# Altium schematic sheet MMA8452Q_Breakoutv10_zv1_1.SchDoc
size 249 x 185 mm
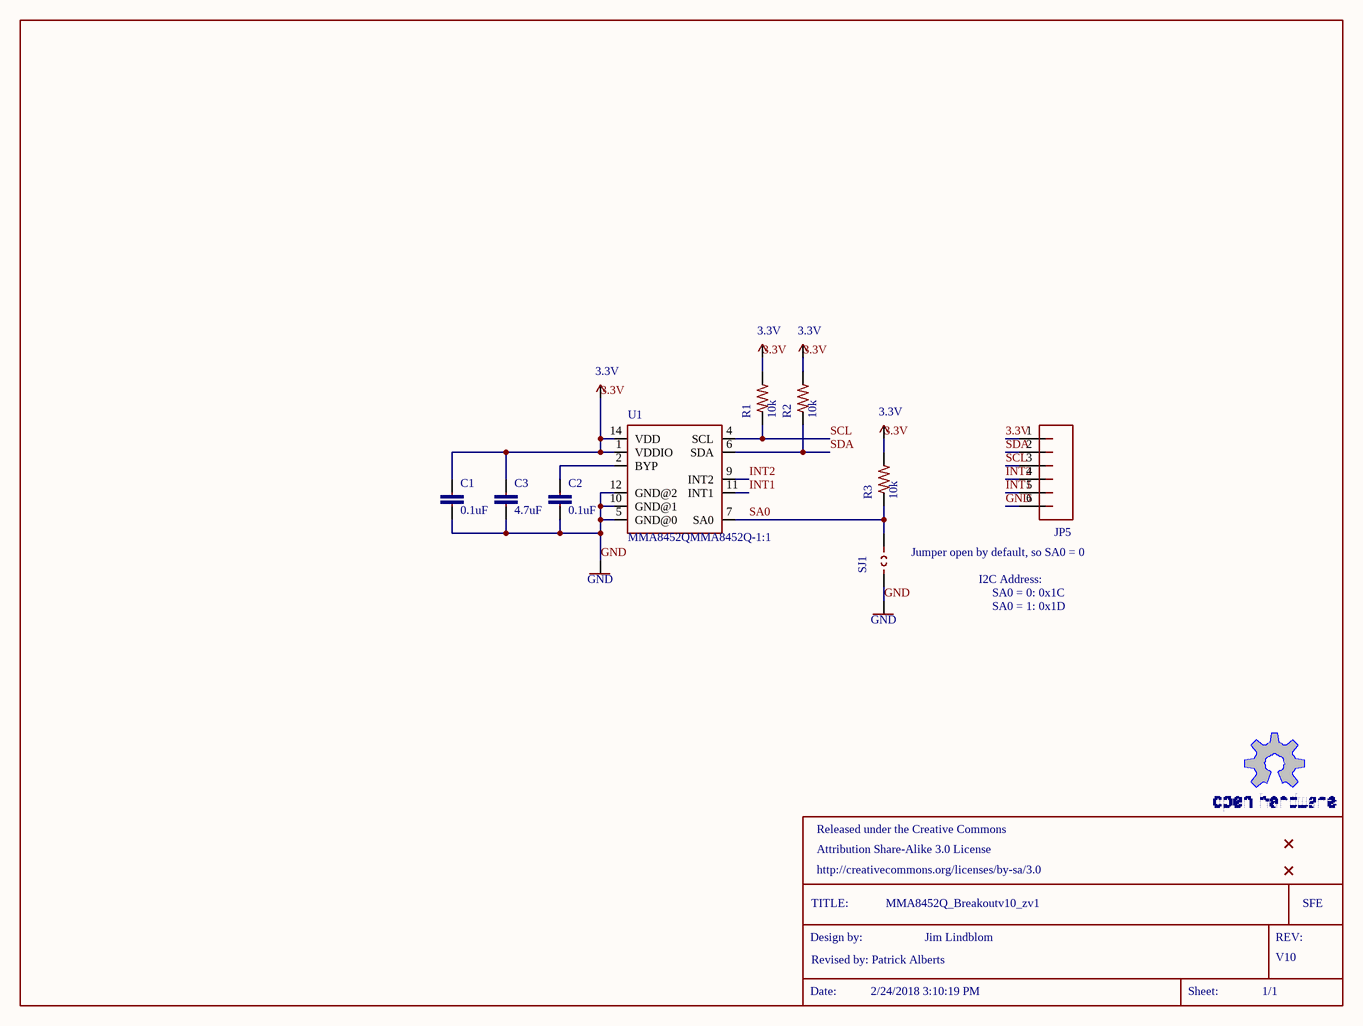
[diagram p0: MMA8452Q_Breakoutv10_zv1_1.SchDoc]

## Parts
C1  0.1uF  [0603-CAP]
C2  0.1uF  [0603-CAP]
C3  4.7uF  [0603-CAP]
FID1  (no value)  [FIDUCIAL-1X2]
FID2  (no value)  [FIDUCIAL-1X2]
FRAME1  (no value)  [CREATIVE_COMMONS]  (parts A,B of 2)
GND1  GND
GND2  GND
JP1  (no value)  [SFE-LOGO-FLAME]
JP3  (no value)  [STAND-OFF]
JP4  (no value)  [STAND-OFF]
JP5  (no value)  [1X06]
P+1  3.3V
P+2  3.3V
P+3  3.3V
P+4  3.3V
R1  10k  [0603-RES]
R2  10k  [0603-RES]
R3  10k  [0603-RES]
SJ1  (no value)  [SJ_2S-NO]
U1  MMA8452QMMA8452Q-1:1  [MMA8452Q-1:1]
U$1  (no value)  [OSHW-LOGO-S]

## Nets
3.3V: C1.1 C3.1 JP5.1 P+1.0(3.3V) P+2.0(3.3V) P+3.0(3.3V) P+4.0(3.3V) R1.2 R2.2 R3.2 U1.1(VDDIO) U1.14(VDD)
GND: C1.2 C2.2 C3.2 GND1.0(GND) GND2.0(GND) JP5.6 SJ1.1 U1.5(GND@0) U1.10(GND@1) U1.12(GND@2)
INT1: JP5.5 U1.11(INT1)
INT2: JP5.4 U1.9(INT2)
SA0: R3.1 SJ1.2 U1.7(SA0)
SCL: JP5.3 R1.1 U1.4(SCL)
SDA: JP5.2 R2.1 U1.6(SDA)
NetC2_1: C2.1 U1.2(BYP)

## Notes on the sheet
- Jumper open by default, so SA0 = 0
- I2C Address:
- SA0 = 0: 0x1C
- SA0 = 1: 0x1D
- (near FRAME1) Revised by: Patrick Alberts
- Jim Lindblom
- (near JP1) V10
- (in symbol FRAME-LETTER, part B) Released under the Creative Commons; Attribution Share-Alike 3.0 License; http://creativecommons.org/licenses/by-sa/3.0; TITLE:; MMA8452Q_Breakoutv10_zv1; Design by:; REV:; Date:; 2/24/2018 3:10:19 PM; Sheet:; 1/1
- (in symbol LOGO-SFESK) SFE

## Library data of the parts
C1 C2 = 0.1UF-25V(+80/-20%)(0603)
C3 = 4.7UF-6.3V-10%(0603)0603
FID1 FID2 = FIDUCIAL1X2
FRAME1 = FRAME-LETTER
JP1 = LOGO-SFESK
JP3 JP4 = STAND-OFF
JP5 = M06SIP
R1-R3 = 10K-1%RES-00824
SJ1 = SOLDERJUMPERNO
U$1 = OSHW-LOGOS